# Altium schematic sheet 02_Overview.SchDoc
size A4; SheetNumber: 2; SheetTotal: 4
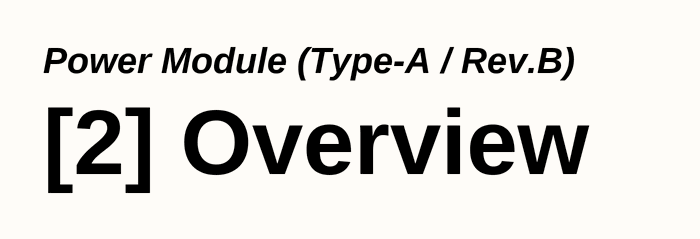
[diagram p0: 02_Overview.SchDoc]

## Notes on the sheet
- Power Module (Type-A / Rev.B)
- [2] Overview
- Title
- Rev
- Doc
- Sheet #
- of
- Author
- This document is copyright of ArkX and shall not be revealed, produced, copied, in whole or in part,
- Date
- ©2024
- nor used for any purpose other than submitted.